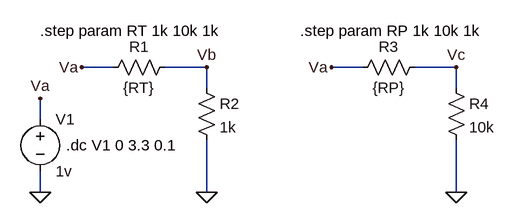
[diagram p0: schematic sweep_resistor.asc]
sweep_resistor.asc, the LTspice schematic file:
Version 4
SHEET 1 880 680
WIRE 160 64 112 64
WIRE 304 64 240 64
WIRE 544 64 496 64
WIRE 688 64 624 64
WIRE 304 96 304 64
WIRE 688 96 688 64
WIRE 48 144 48 112
WIRE 48 256 48 224
WIRE 304 256 304 176
WIRE 688 256 688 176
FLAG 48 256 0
FLAG 48 112 Va
FLAG 304 256 0
FLAG 112 64 Va
FLAG 688 256 0
FLAG 496 64 Va
FLAG 304 64 Vb
FLAG 688 64 Vc
SYMBOL voltage 48 128 R0
WINDOW 123 0 0 Left 0
WINDOW 39 0 0 Left 0
SYMATTR InstName V1
SYMATTR Value 1v
SYMBOL res 144 80 R270
WINDOW 0 32 56 VTop 2
WINDOW 3 0 56 VBottom 2
SYMATTR InstName R1
SYMATTR Value {RT}
SYMBOL res 288 80 R0
SYMATTR InstName R2
SYMATTR Value 1k
SYMBOL res 528 80 R270
WINDOW 0 32 56 VTop 2
WINDOW 3 0 56 VBottom 2
SYMATTR InstName R3
SYMATTR Value {RP}
SYMBOL res 672 80 R0
SYMATTR InstName R4
SYMATTR Value 10k
TEXT 88 184 Left 2 !.dc V1 0 3.3 0.1
TEXT 48 8 Left 2 !.step param RT 1k 10k 1k
TEXT 448 8 Left 2 !.step param RP 1k 10k 1k

The netlist it stands for:
* sweep_resistor.asc
V1 Va 0 1v
R1 Va Vb {RT}
R2 Vb 0 1k
R3 Va Vc {RP}
R4 Vc 0 10k
.dc V1 0 3.3 0.1
.step param RT 1k 10k 1k
.step param RP 1k 10k 1k
.backanno
.end

* Results of the author's LTspice run, read from the files saved beside the schematic
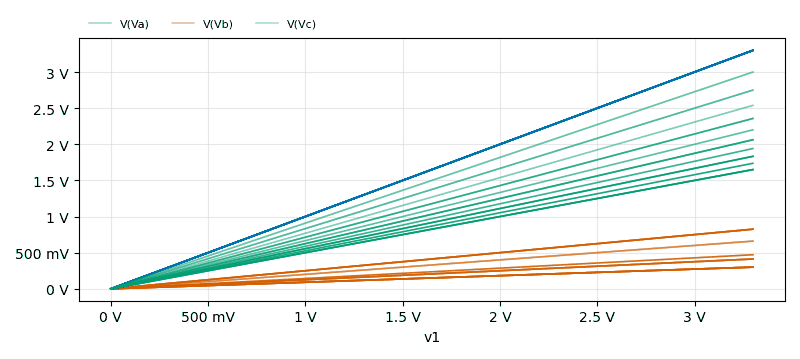
[diagram p1: DC transfer characteristic of sweep_resistor.asc, plotted from the saved traces]
* DC transfer characteristic, 100 runs:
*   V(Va) [run 1]: 0 V at v1=0 V, 3.3 V at v1=3.3 V, min 0 V, max 3.3 V
*   V(Va) [run 2]: 0 V at v1=0 V, 3.3 V at v1=3.3 V, min 0 V, max 3.3 V
*   V(Va) [run 3]: 0 V at v1=0 V, 3.3 V at v1=3.3 V, min 0 V, max 3.3 V
*   V(Va) [run 4]: 0 V at v1=0 V, 3.3 V at v1=3.3 V, min 0 V, max 3.3 V
*   V(Va) [run 5]: 0 V at v1=0 V, 3.3 V at v1=3.3 V, min 0 V, max 3.3 V
*   V(Va) [run 6]: 0 V at v1=0 V, 3.3 V at v1=3.3 V, min 0 V, max 3.3 V
*   V(Va) [run 7]: 0 V at v1=0 V, 3.3 V at v1=3.3 V, min 0 V, max 3.3 V
*   V(Va) [run 8]: 0 V at v1=0 V, 3.3 V at v1=3.3 V, min 0 V, max 3.3 V
*   V(Vb) [run 1]: 0 V at v1=0 V, 1.65 V at v1=3.3 V, min 0 V, max 1.65 V
*   V(Vb) [run 2]: 0 V at v1=0 V, 412.5 mV at v1=3.3 V, min 0 V, max 412.5 mV
*   V(Vb) [run 3]: 0 V at v1=0 V, 660 mV at v1=3.3 V, min 0 V, max 660 mV
*   V(Vb) [run 4]: 0 V at v1=0 V, 300 mV at v1=3.3 V, min 0 V, max 300 mV
*   V(Vb) [run 5]: 0 V at v1=0 V, 412.5 mV at v1=3.3 V, min 0 V, max 412.5 mV
*   V(Vb) [run 6]: 0 V at v1=0 V, 660 mV at v1=3.3 V, min 0 V, max 660 mV
*   V(Vb) [run 7]: 0 V at v1=0 V, 300 mV at v1=3.3 V, min 0 V, max 300 mV
*   V(Vb) [run 8]: 0 V at v1=0 V, 412.5 mV at v1=3.3 V, min 0 V, max 412.5 mV
*   V(Vc) [run 1]: 0 V at v1=0 V, 3 V at v1=3.3 V, min 0 V, max 3 V
*   V(Vc) [run 2]: 0 V at v1=0 V, 3 V at v1=3.3 V, min 0 V, max 3 V
*   V(Vc) [run 3]: 0 V at v1=0 V, 2.75 V at v1=3.3 V, min 0 V, max 2.75 V
*   V(Vc) [run 4]: 0 V at v1=0 V, 2.75 V at v1=3.3 V, min 0 V, max 2.75 V
*   V(Vc) [run 5]: 0 V at v1=0 V, 2.538 V at v1=3.3 V, min 0 V, max 2.538 V
*   V(Vc) [run 6]: 0 V at v1=0 V, 2.357 V at v1=3.3 V, min 0 V, max 2.357 V
*   V(Vc) [run 7]: 0 V at v1=0 V, 2.357 V at v1=3.3 V, min 0 V, max 2.357 V
*   V(Vc) [run 8]: 0 V at v1=0 V, 2.2 V at v1=3.3 V, min 0 V, max 2.2 V